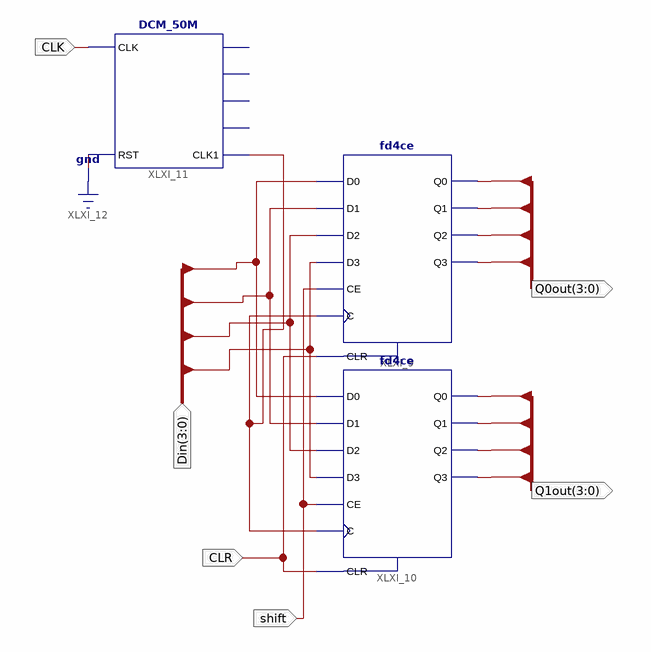
[diagram p0: schematic sheet 1]
// Xilinx ISE schematic shiftreg_hex2D.sch (spartan3e) as structural Verilog: 3 symbols, 6 ports
module shiftreg_hex2D (
  input  CLR,
  input  [3:0] Din,
  input  shift,
  input  CLK,
  output [3:0] Q0out,
  output [3:0] Q1out
);

  wire XLXN_29;

  fd4ce XLXI_9 (
    .C(XLXN_29), .CE(shift), .CLR(CLR), .D0(Din[0]), .D1(Din[1]), .D2(Din[2]), .D3(Din[3]), .Q0(Q0out[0]),
    .Q1(Q0out[1]), .Q2(Q0out[2]), .Q3(Q0out[3]));
  fd4ce XLXI_10 (
    .C(XLXN_29), .CE(shift), .CLR(CLR), .D0(Din[0]), .D1(Din[1]), .D2(Din[2]), .D3(Din[3]), .Q0(Q1out[0]),
    .Q1(Q1out[1]), .Q2(Q1out[2]), .Q3(Q1out[3]));
  DCM_50M XLXI_11 (.CLK(CLK), .RST(1'b0), .CLK1(XLXN_29));  // open: CLK1M, CLK10k, CLK1k, CLK100
endmodule
